# EasyEDA schematic SCH Navigation Remote.json
TITLE: Sheet_1; REV: 1.0; Date: 2025-01-16; Sheet: 1/1; Drawn By: shehandinusha37; Company: Your Company
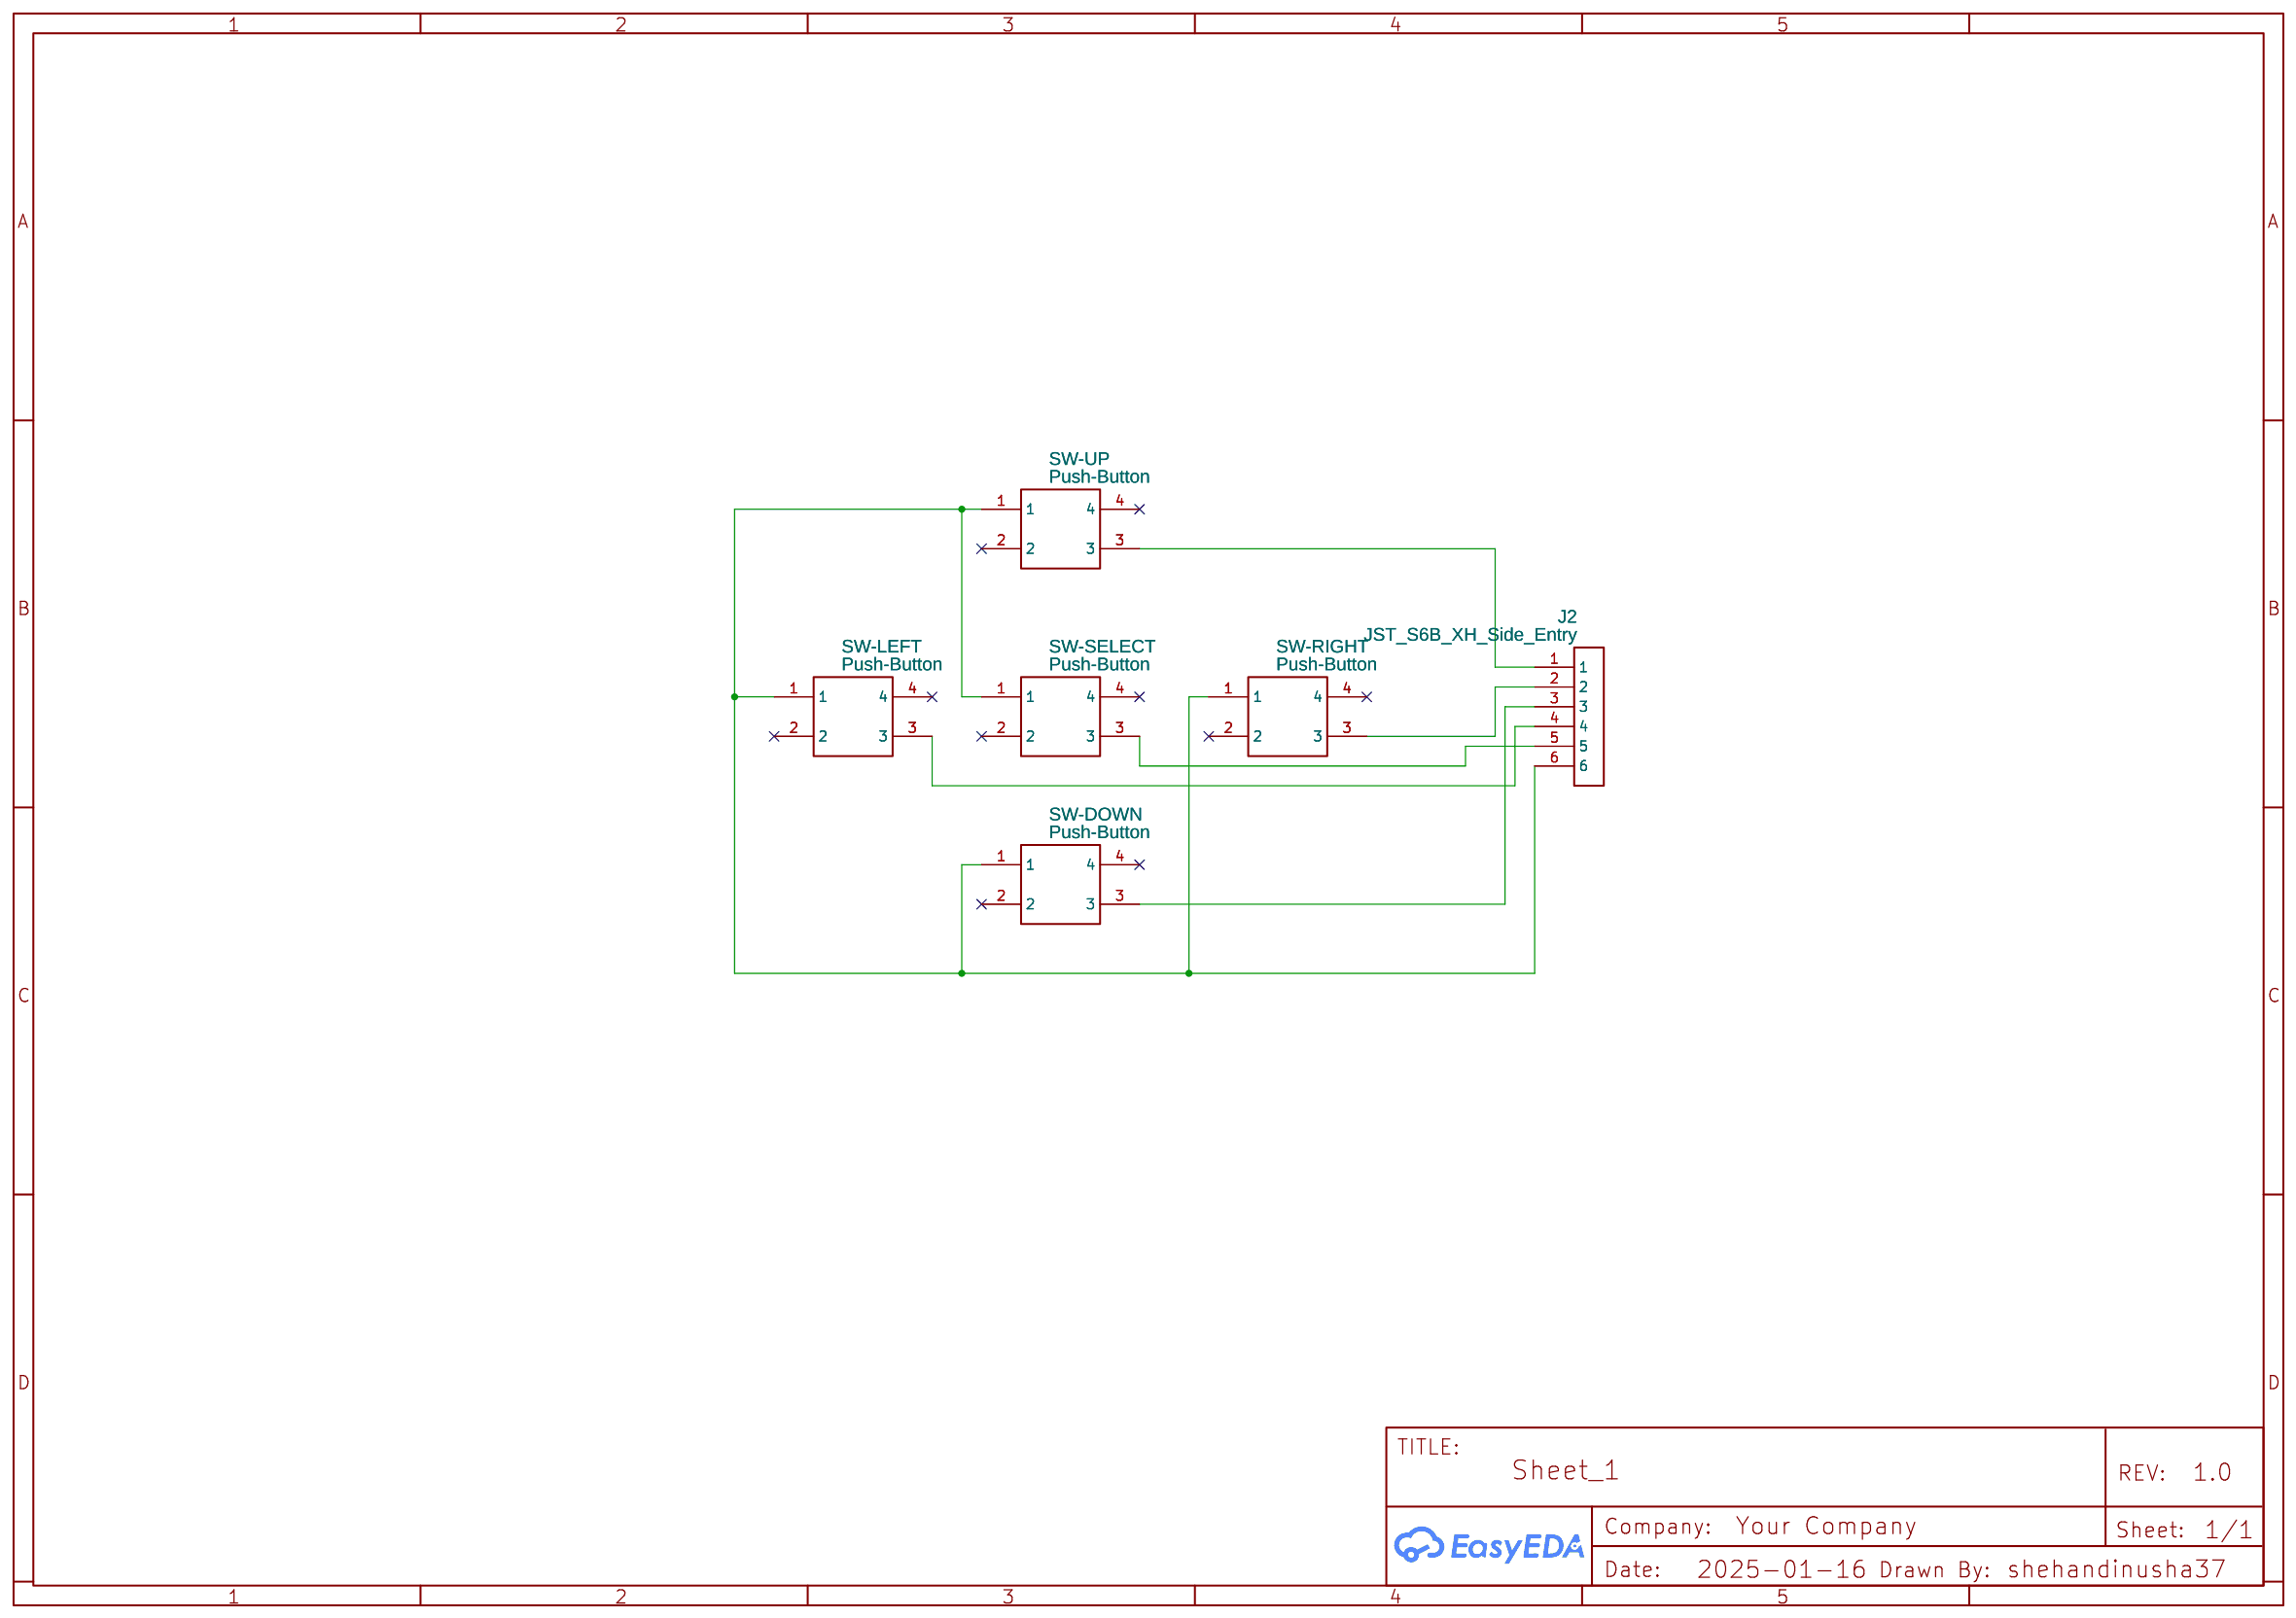
[diagram p0: schematic sheet]

## Parts
J2  JST_S6B_XH_Side_Entry  [JST_S6B_XH_SIDE_ENTRY]
SW-DOWN  Push-Button  [PB 4PIN 200 X 500]
SW-LEFT  Push-Button  [PB 4PIN 200 X 500]
SW-RIGHT  Push-Button  [PB 4PIN 200 X 500]
SW-SELECT  Push-Button  [PB 4PIN 200 X 500]
SW-UP  Push-Button  [PB 4PIN 200 X 500]

## Library data of the parts
J2 = JST_S6B_XH_Side_Entry: Contributor: morenitoo
SW-DOWN SW-LEFT SW-RIGHT SW-SELECT SW-UP = PB 200 x 500 - 2: Contributor: Venkat Yalamati

## Nets
Net-(J2-1): J2.1 SW-UP.3
Net-(J2-2): J2.2 SW-RIGHT.3
Net-(J2-3): J2.3 SW-DOWN.3
Net-(J2-4): J2.4 SW-LEFT.3
Net-(J2-5): J2.5 SW-SELECT.3
Net-(J2-6): J2.6 SW-DOWN.1 SW-LEFT.1 SW-RIGHT.1 SW-SELECT.1 SW-UP.1

Not connected (* = marked no-connect by the designer): SW-DOWN 2* 4*; SW-LEFT 2* 4*; SW-RIGHT 2* 4*; SW-SELECT 2* 4*; SW-UP 2* 4*
